# EAGLE design UV_MONITOR_V2_4 (EAGLE 8.4.0)
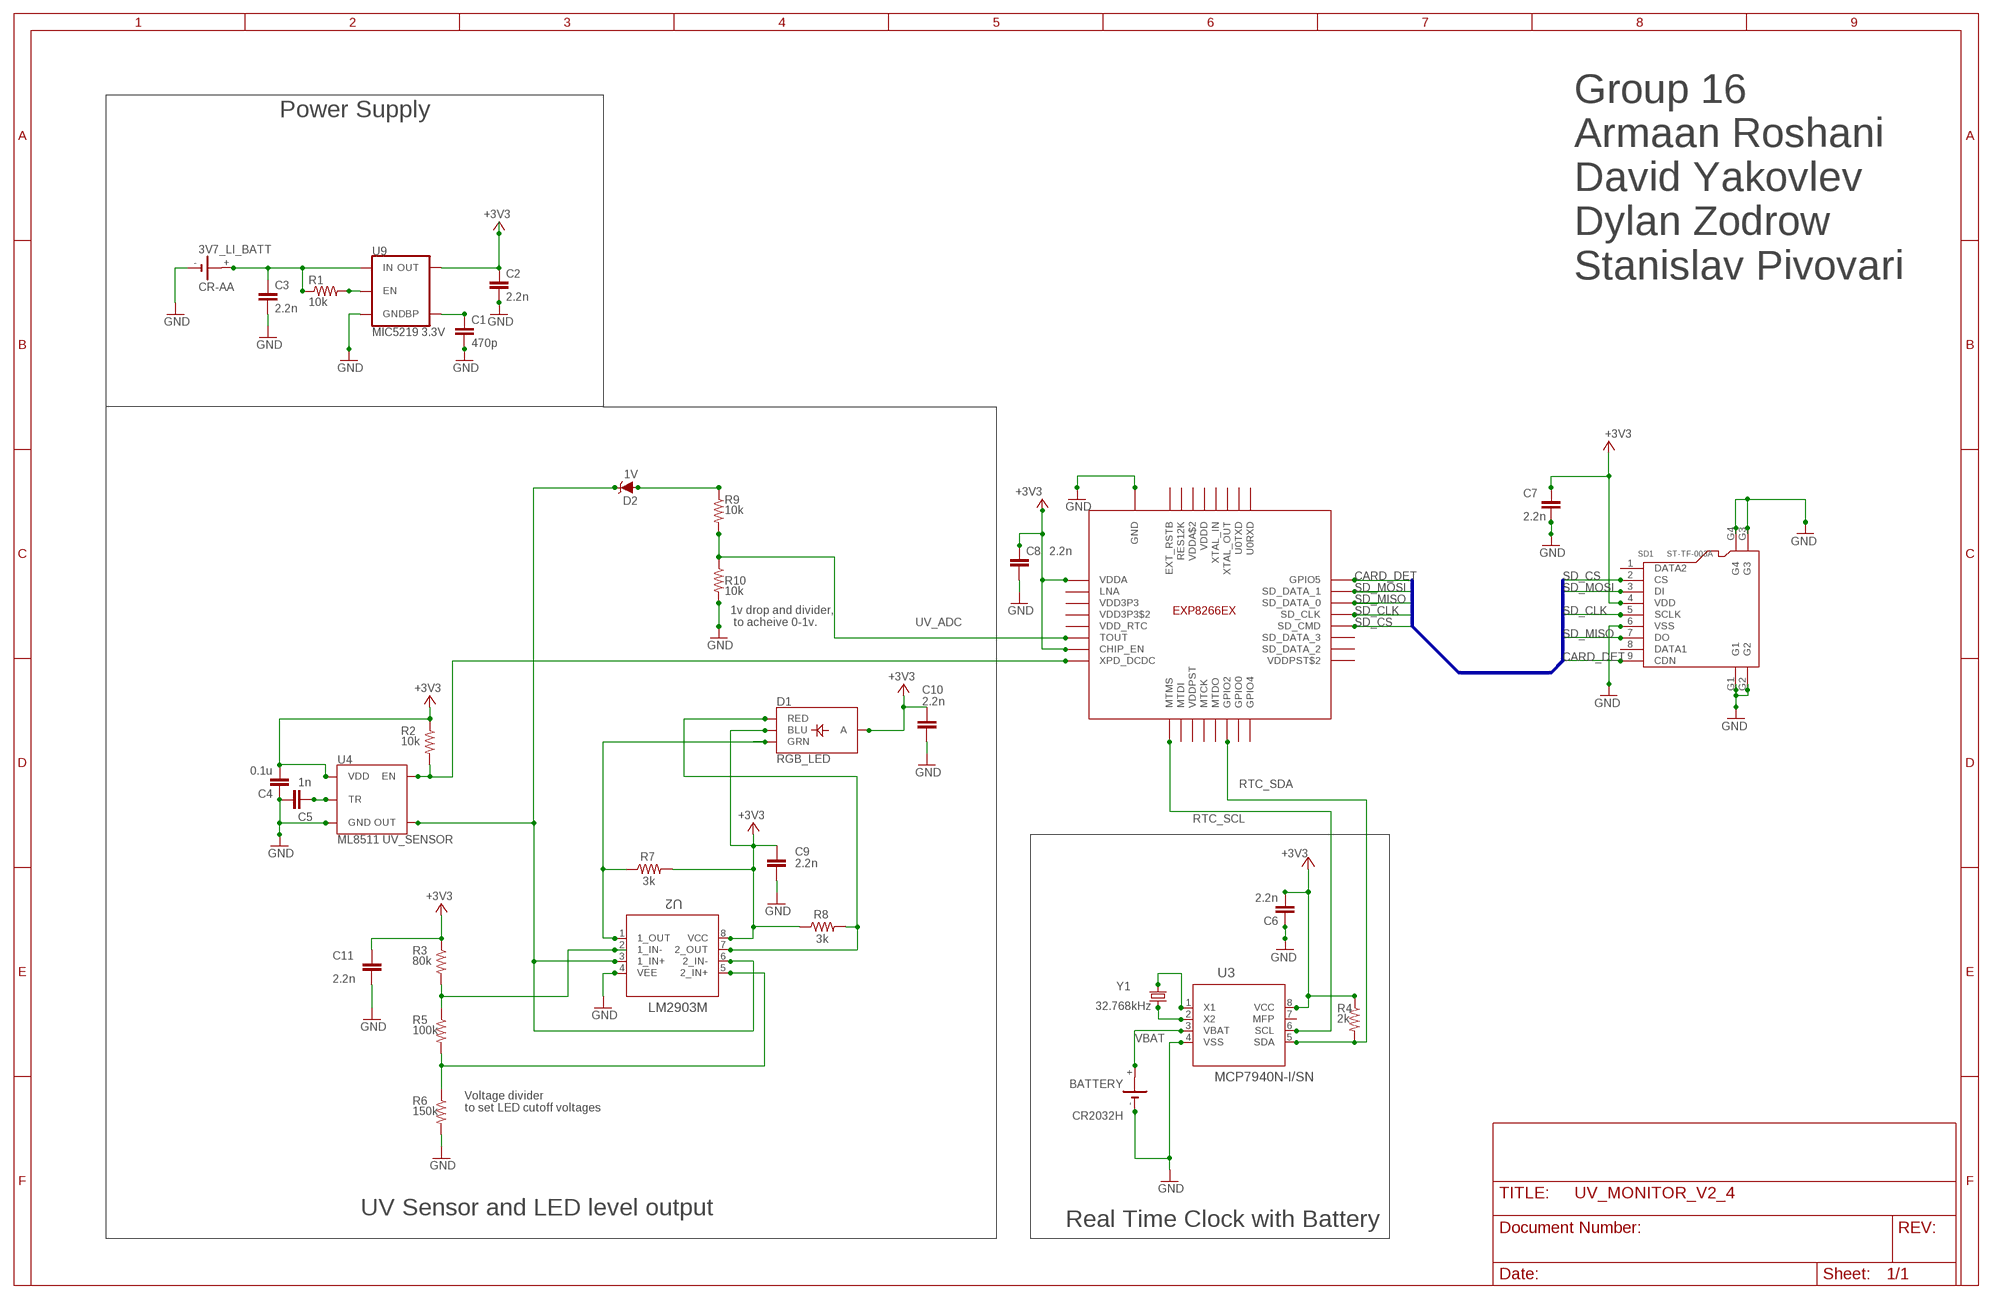
[diagram p0: schematic, sheet 1]

## Parts
3V7_LI_BATT  CR-AA  [CRAA]
BATTERY  CR2032H  [CR2032H]
C1  470p  C-EUC0805  [C0805]
C2  2.2n  C-EUC0805  [C0805]
C3  2.2n  C-EUC0805  [C0805]
C4  0.1u  C-EUC0805  [C0805]
C5  1n  C-EUC0805  [C0805]
C6  2.2n  C-EUC0805  [C0805]
C7  2.2n  C-EUC0805  [C0805]
C8  2.2n  C-EUC0805  [C0805]
C9  2.2n  C-EUC0805  [C0805]
C10  2.2n  C-EUC0805  [C0805]
C11  2.2n  C-EUC0805  [C0805]
D1  RGB_LED  LED-RGB-CASMD  [LED-TRICOLOR-SMD]
D2  1V  DIODE-ZENER-BZT52C3V6S  [SOD-323]
R1  10k  R-US_R0805  [R0805]
R2  10k  R-US_R0805  [R0805]
R3  80k  R-US_R0805  [R0805]
R4  2k  R-US_R0805  [R0805]
R5  100k  R-US_R0805  [R0805]
R6  150k  R-US_R0805  [R0805]
R7  3k  R-US_R0805  [R0805]
R8  3k  R-US_R0805  [R0805]
R9  10k  R-US_R0805  [R0805]
R10  10k  R-US_R0805  [R0805]
SD1  ST-TF-003A  MICRO-SD-CARD-SOCKET-9P(ST-TF-003A)  [MICRO-SD9+4P-SMD-16.1X14.5X1.85MM]
U1  ESP8266EX  [ESP8266EX]
U2  LM2903M  [M08A]
U3  MCP7940N-I/SN  [SOIC8-N_MC]
U4  ML8511 UV_SENSOR  ML8511  [ML8511]
U9  MIC5219 3.3V  V_REG_MIC52193.3V  [SOT23-5]
Y1  32.768kHz  CRYSTAL-32.768KHZSMD-2X6  [CRYSTAL-SMD-2X6-CYL]

## Nets
+3V3: C2.1 C4.2 C6.2 C7.1 C8.1 C9.1 C10.1 C11.1 D1.A D1.B(BLU) R2.1 R3.1 R4.1 R7.2 R8.1 SD1.4(VDD) U1.CHIP_EN U1.VDDA U2.8(VCC) U3.8(VCC) U4.7(VDD) U9.5(OUT)
BP: C1.1 U9.4(BP)
CARD_DET: SD1.9(CDN) U1.GPOIO5(GPIO5)
EN: R1.2 U9.3(EN)
GND: 3V7_LI_BATT.- BATTERY.- C1.2 C2.2 C3.2 C4.1 C5.2 C6.1 C7.2 C8.2 C9.2 C10.2 C11.2 R6.2 R10.2 SD1.6(VSS) SD1.G1 SD1.G2 SD1.G3 SD1.G4 U1.GND U2.4(VEE) U3.4(VSS) U4.5(GND) U9.2(GND)
GREEN_LED: D1.G(GRN) R7.1 U2.1(1_OUT)
H_REF: R3.2 R5.1 U2.2(1_IN-)
L_REF: R5.2 R6.1 U2.5(2_IN+)
MAIN_BAT: 3V7_LI_BATT.+ C3.1 R1.1 U9.1(IN)
N$2: U3.2(X2) Y1.X1
N$6: U3.1(X1) Y1.X2
RED_LED: D1.R(RED) R8.2 U2.7(2_OUT)
RTC_SCL: U1.MTMS U3.6(SCL)
RTC_SDA: R4.2 U1.GPIO2 U3.5(SDA)
SD_CLK: SD1.5(SCLK) U1.SD_CLK
SD_CS: SD1.2(CS) U1.SD_CMD
SD_MISO: SD1.7(DO) U1.SD_DATA_0
SD_MOSI: SD1.3(DI) U1.SD_DATA_1
TR: C5.1 U4.10(TR)
UV_ADC: R9.2 R10.1 U1.TOUT
UV_ADC_1: D2.A R9.1
UV_ADC_2: D2.C U2.3(1_IN+) U2.6(2_IN-) U4.8(OUT)
UV_SEN_EN: R2.2 U1.XPD_DCDC U4.4(EN)
VBAT: BATTERY.+ U3.3(VBAT)
Unconnected: 3V7_LI_BATT.+@1(+) BATTERY.+@1(+) SD1.1(DATA2) SD1.8(DATA1) U1.EXT_RSTB U1.GPIO0 U1.GPIO4 U1.LNA U1.MTCK U1.MTDI U1.MTDO U1.RES12K U1.SD_DATA_2 U1.SD_DATA_3 U1.U0RXD U1.U0TXD U1.VDD3P3 U1.VDD3P3$2 U1.VDD_RTC U1.VDDA$2 U1.VDDD U1.VDDPST U1.VDDPST$2 U1.XTAL_IN U1.XTAL_OUT U3.7(MFP)

## Buses
SD_CARD

## Notes on the sheet
- Power Supply
- Group 16
  Armaan Roshani
  David Yakovlev
  Dylan Zodrow
  Stanislav Pivovari
- 1v drop and divider,
   to acheive 0-1v.
- Voltage divider
  to set LED cutoff voltages
- UV Sensor and LED level output
- Real Time Clock with Battery

## Library data of the parts
3V7_LI_BATT = battery:CR-AA: LI BATTERY Varta CRAA-SLF
BATTERY = battery:CR2032H: LI BATTERY Varta
C1-C11 = rcl:C-EU: CAPACITOR, European symbol
D1 = SparkFun-LED:LED-RGB-CA: LED-RGB Diffused Common Anode Packages: LED RGB-THRU P-LCC-4-3 LED-TRICOLOR-SMD SparkFun Products: RGB Diffused Common Anode- Diffuse <[https://www.sparkfun.com/products/10821]> RGB Diffused Common Anode - Clear <[https://www.sparkfun.com/products/10820]> Qduino Mini <[https://www.sparkfun.com/products/13614]> Triple Output LED RGB - SMD <https://www.sparkfun.com/products/7844>; PROD_ID: DIO-08324
D2 = SparkFun-DiscreteSemi:DIODE-ZENER: Zener Diode A Zener diode allows current to flow from its anode to its cathode like a normal semiconductor diode, but it also permits current to flow in the reverse direction when its "Zener voltage" is reached. - WIkipedia; PROD_ID: DIO-08199; VALUE: 3.6V
R1-R10 = rcl:R-US_: RESISTOR, American symbol
SD1 = Seeed-Connector:MICRO-SD-CARD-SOCKET-9P(ST-TF-003A): 320090000; MPN: ST-TF-003A
U1 = ESP8266EX:ESP8266EX
U2 = LM2903M:LM2903M; MANUFACTURER_PART_NUMBER: LM2903M; VENDOR: Texas Instruments
U3 = MCP7940N:MCP7940N-I/SN; MANUFACTURER_PART_NUMBER: MCP7940NISN; VENDOR: MICROCHIP
U4 = SparkFun-Sensors:ML8511: Lapis ML8511 Ultraviolet Sensor The MP8511 UV (ultraviolet) Sensor works by outputing an analog signal in relation to the amount of UV light that’s detected. This sensor detects 280-390nm light most effectively. This is categorized as part of the UVB (burning rays) spectrum and most of the UVA (tanning rays) spectrum. It outputs a analog voltage that is linearly related to the measured UV intensity (mW/cm2). Datasheet <https://cdn.sparkfun.com/datasheets/Sensors/LightImaging/ML8511_3-8-13.pdf> SparkFun Products SparkFun UV Sensor Breakout - ML8511 <https://www.sparkfun.com/products/12705> (SEN-12705); PROD_ID: IC-11927
U9 = SparkFun-IC-Power:V_REG_MIC5219: V_REG MIC5219 Standard 3.3V and 5V 500mA LDO voltage regulator in SOT-23 layout. Micrel part MIC5219. BP (by-pass) pin is used to lower output noise with 470pF cap, may be left open.; PROD_ID: VREG-09872
Y1 = SparkFun-Clocks:CRYSTAL-32.768KHZ: 32.768kHz Crystal Frequency: 32.768kHz Frequency Stability: ±20ppm Load Capacitance: 12.5pF (PTH-2X6 & SMD-3.2X1.5), 6pF (SMD-2X6) SparkFun Products: SparkFun BigTime Watch Kit <https://www.sparkfun.com/products/11734> SparkFun nRF52832 Breakout <https://www.sparkfun.com/products/13990> SparkFun Real Time Clock Module <https://www.sparkfun.com/products/12708>; PROD_ID: XTAL-07894

## Net classes
0 default: clearance 0.205 mm

## Board
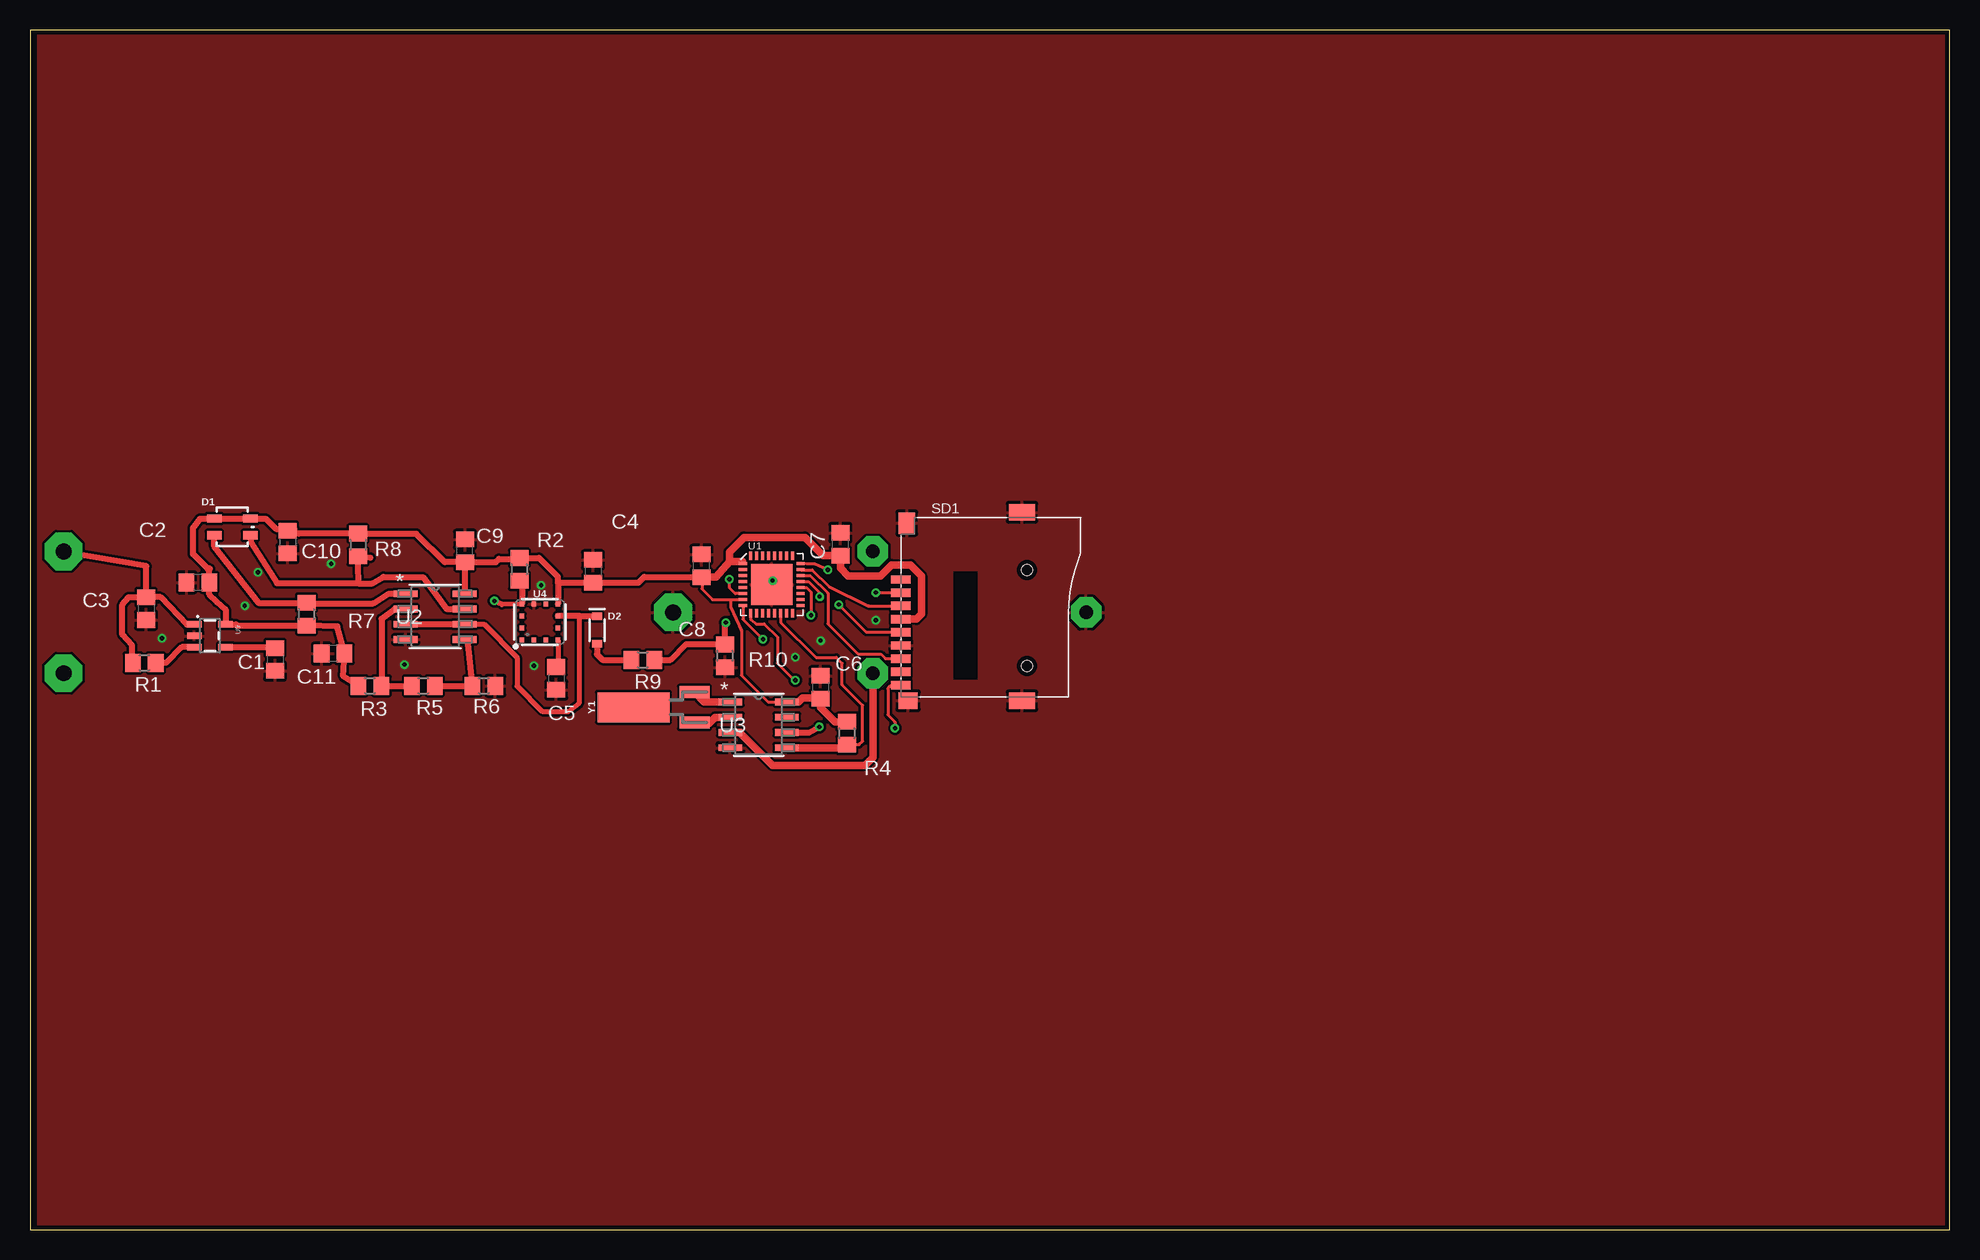
[diagram p1: board, top side]
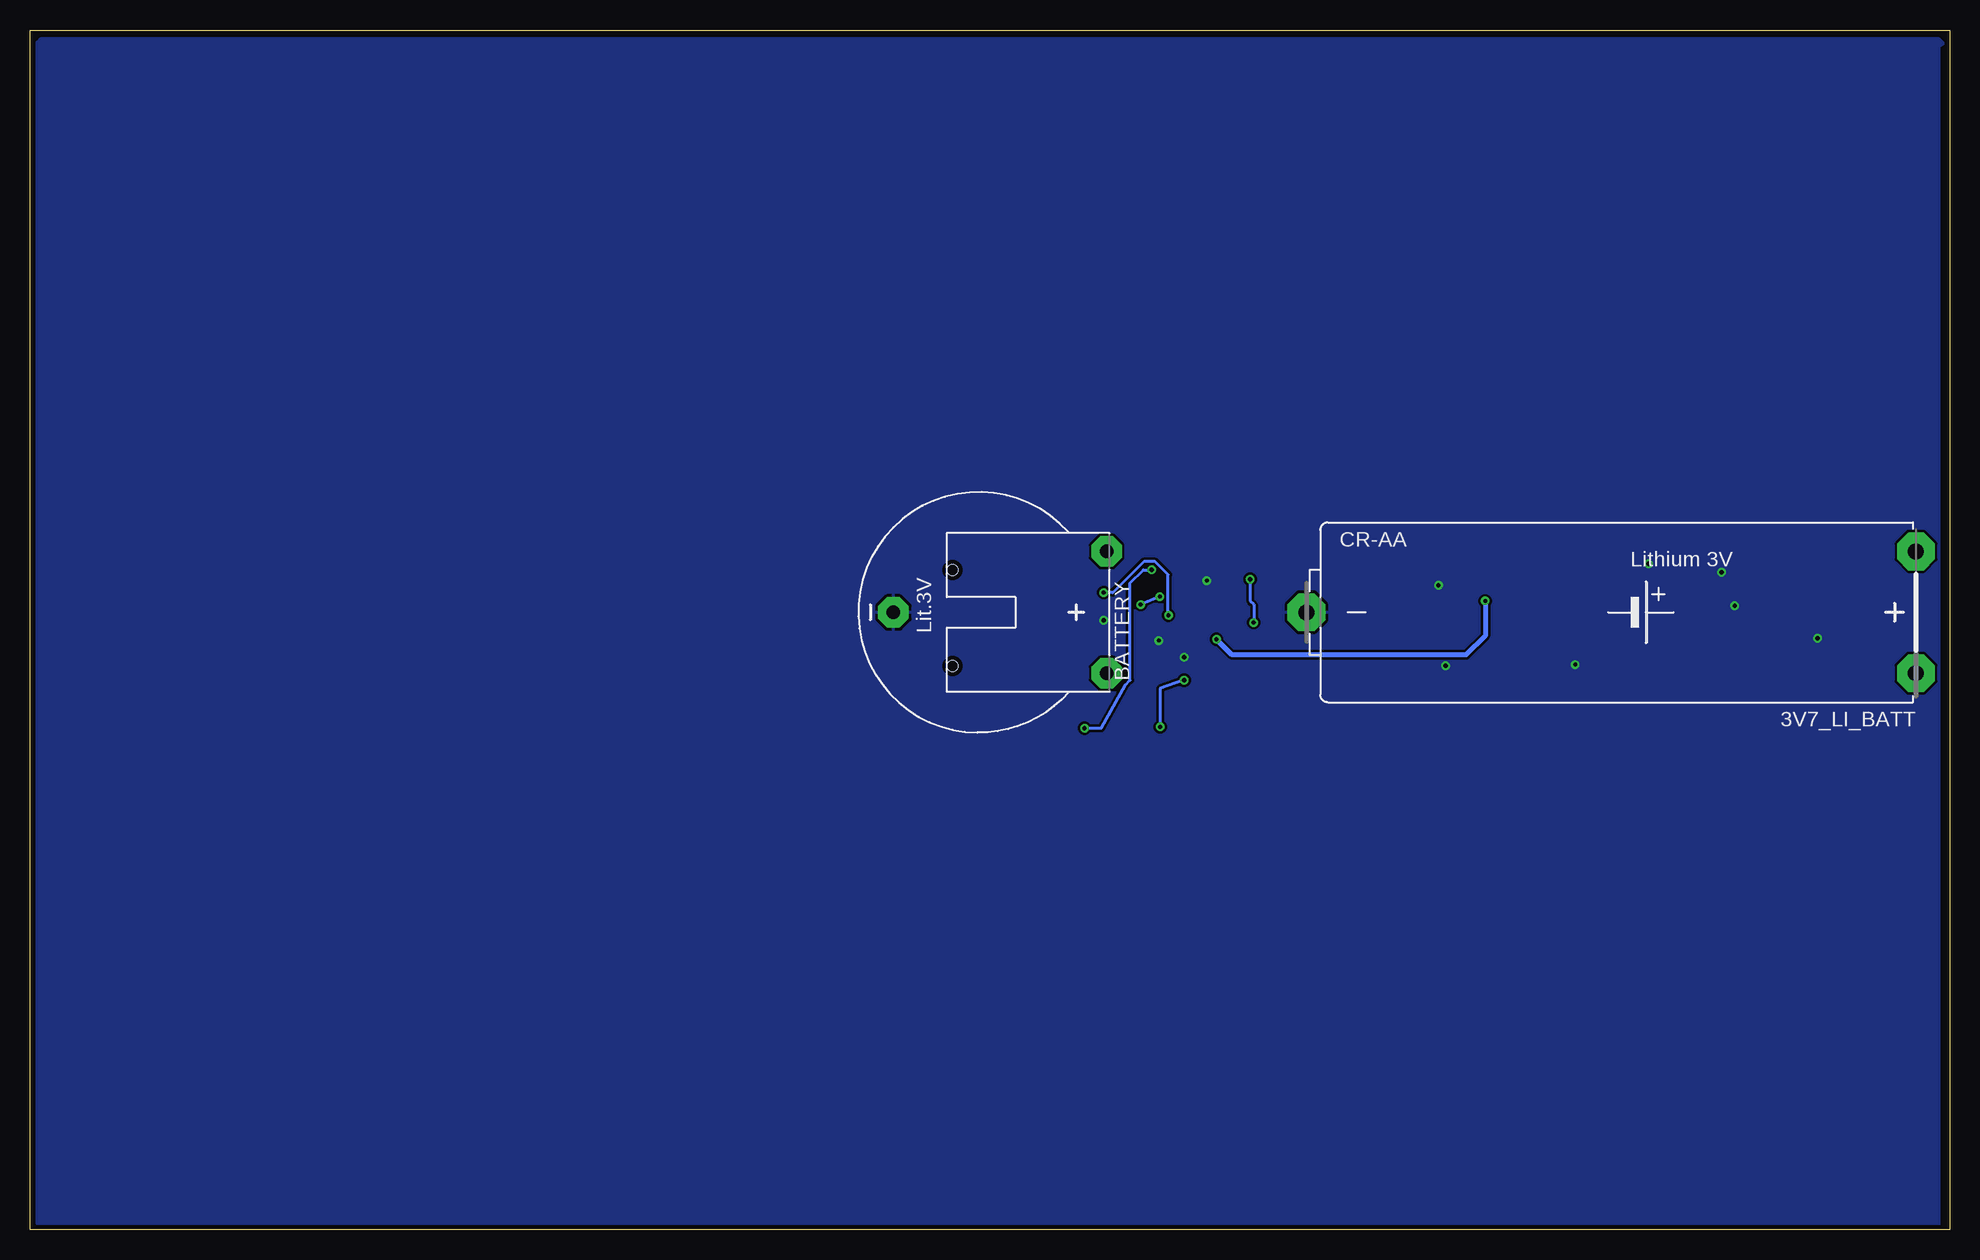
[diagram p2: board, bottom side, seen from below]

Size 160 x 100 mm. Coordinates in mm from the lower left corner, seen from the top.
Outline: 0,0 160,0 160,100 0,100 0,0
Copper layers (1*16): Top 0.0356mm / dielectric 1.5011mm / Bottom 0.0356mm
Design rules "osh-park-2-layers-design-rules": minimum track width 6mil, minimum drill 10mil, track to track 6mil, track to pad 6mil, pad to pad 6mil, via to via 6mil, smd to smd 6mil, copper to edge 15mil, drill to drill 6mil, minimum pad ring 7mil, minimum via ring 7mil, stop-mask expansion 3mil, vias tented up to drill 0mil, thermal gap 10mil

### Footprints (pad centres in the part's own frame; a part is rotated, then mirrored left to right if it is on the bottom)
CRAA = drill 1.321 pad 3.15 octagon: + -25.4,-5.08; +@1 -25.4,5.08; - 25.4,0
CR2032H = drill 1.118 pad 2.54 octagon: + 5.08,10.795; +@1 -5.08,10.795; - 0,-6.985
C0805 = smd 1.3 x 1.5: 1 -0.95,0; 2 0.95,0
LED-TRICOLOR-SMD = smd 1.2 x 0.7: A 1.5,0.7; B -1.5,0.7; G -1.5,-0.7; R 1.5,-0.7
SOD-323 = smd 0.63 x 0.83: A 1.15,0; C -1.15,0
R0805 = smd 1.3 x 1.5: 1 -0.95,0; 2 0.95,0
MICRO-SD9+4P-SMD-16.1X14.5X1.85MM = smd 1.6 x 0.7: 1 0,2.25; 2 0,1.15; 3 0,0.05; 4 0,-1.05; 5 0,-2.15; 6 0,-3.25; 7 0,-4.35; 8 0,-5.45; 9 0,-6.55 | smd 1.6 x 1.4: G1 0.6,-7.85 | smd 2.2 x 1.4: G2 10.1,-7.85; G3 10.1,7.85 | smd 1.4 x 1.8: G4 0.5,6.95 | hole 0.9: 10.5,-4.95; 10.5,3.05
ESP8266EX = smd 0.7 x 0.25: CHIP_EN -2.4,-1.25; GPOIO5 2.4,1.75; LNA -2.4,1.25; SD_CLK 2.4,0.25; SD_CMD 2.4,-0.25; SD_DATA_0 2.4,0.75; SD_DATA_1 2.4,1.25; SD_DATA_2 2.4,-1.25; SD_DATA_3 2.4,-0.75; TOUT -2.4,-0.75; VDD3P3 -2.4,0.75; VDD3P3$2 -2.4,0.25; VDD_RTC -2.4,-0.25; VDDA -2.4,1.75; VDDPST$2 2.4,-1.75; XPD_DCDC -2.4,-1.75 | smd 0.25 x 0.7: EXT_RSTB -1.75,2.4; GPIO0 1.25,-2.4; GPIO2 0.75,-2.4; GPIO4 1.75,-2.4; MTCK -0.25,-2.4; MTDI -1.25,-2.4; MTDO 0.25,-2.4; MTMS -1.75,-2.4; RES12K -1.25,2.4; U0RXD 1.75,2.4; U0TXD 1.25,2.4; VDDA$2 -0.75,2.4; VDDD -0.25,2.4; VDDPST -0.75,-2.4; XTAL_IN 0.25,2.4; XTAL_OUT 0.75,2.4 | smd 3.45 x 3.45: GND 0,0
M08A = smd 1.981 x 0.559: 1 -2.464,1.905; 2 -2.464,0.635; 3 -2.464,-0.635; 4 -2.464,-1.905; 5 2.464,-1.905; 6 2.464,-0.635; 7 2.464,0.635; 8 2.464,1.905
SOIC8-N_MC = smd 1.981 x 0.559: 1 -2.362,1.905; 2 -2.362,0.635; 3 -2.362,-0.635; 4 -2.362,-1.905; 5 2.362,-1.905; 6 2.362,-0.635; 7 2.362,0.635; 8 2.362,1.905
ML8511 = smd 0.4 x 0.4: 1 -1.5,-1.5; 2 -1.5,-0.5; 3 -1.5,0.5; 4 -1.5,1.5; 5 -0.5,1.5; 6 0.5,1.5; 7 1.5,1.5; 8 1.5,0.5; 9 1.5,-0.5; 10 1.5,-1.5; 11 0.5,-1.5; 12 -0.5,-1.5
SOT23-5 = smd 0.55 x 1.2: 1 -0.95,-1.3; 2 0,-1.3; 3 0.95,-1.3; 4 0.95,1.3; 5 -0.95,1.3
CRYSTAL-SMD-2X6-CYL = smd 2.5 x 6: SHEILD 0,5.08 | smd 1 x 2.5: X1 -1.27,0; X2 1.27,0

### Placement (x,y rotation side)
3V7_LI_BATT  28.2,51.45 180 bottom
BATTERY  81.05,51.45 270 bottom
C1  20.43,47.52 270 top
C2  14,53.95 180 top
C3  9.68,51.76 270 top
C4  46.93,54.87 270 top
C5  43.87,45.95 270 top
C6  65.89,45.21 270 top
C7  67.55,57.13 90 top
C8  55.97,55.33 90 top
C9  36.25,56.58 90 top
C10  21.47,57.31 270 top
C11  25.26,48.02 180 top
D1  16.86,58.57 0 top
D2  47.26,49.97 270 top
R1  9.53,47.25 0 top
R2  40.8,55.03 270 top
R3  28.34,45.33 0 top
R4  68.09,41.37 270 top
R5  32.79,45.33 0 top
R6  37.84,45.33 0 top
R7  23.05,51.3 270 top
R8  27.35,57.07 270 top
R9  51.08,47.49 0 top
R10  57.92,47.82 270 top
SD1  72.59,51.94 0 top
U1  61.83,53.77 0 top
U2  33.77,51.1 0 top
U3  60.73,42.07 0 top
U4  42.5,50.65 0 top
U9  15,49.5 270 top
Y1  55.38,43.54 90 top

### Tracks (layer width: path | path; a pad name or v marks a point on that pad's centre or on a via)
+3V3
  Top 0.254: 59.41,55.7 U1.VDDA | C8.1 56,54.35 56,53.4 56.88,52.52 58.4,52.52 | 58.4,52.52 U1.CHIP_EN | 58.4,52.52 58.4,51.9 59.3,49.9 59.3,46.2 61.52,43.98 U3.8
  Top 0.508: 16.3,51.7 U9.5 17.15,50.45 17.25,50.35 R7.2 25.61,50.29 C11.1 26.11,46.11 R3.1 | 16.3,51.7 | 16.3,51.7 15.6,52.3 14.95,52.95 C2.1 14.95,55.05 15,55.1 14.8,55.1 13.6,56.3 13.6,58.5 14.17,59.27 D1.B D1.A 19.63,59.27 20.5,58.4 22.03,58.4 C10.1 22.41,58.02 R8.1 27.37,58 32.2,58 34.57,55.63 C9.1 | C9.1 36.23,55.61 U2.8 | C9.1 38.83,55.63 39.1,55.9 40.72,55.9 R2.1 42.42,55.98 44,54.4 44,53.9 | 44,53.9 U4.7 | 44,53.9 44.02,53.92 C4.2 50.72,53.92 51.2,54.4 55.95,54.4 C8.1
  Top 0.61: C8.1 57.18,54.38 58.3,55.7 | 58.3,55.7 59.41,55.7 | U3.8 64.08,43.98 64.4,44.3 65.85,44.3 C6.2 65.89,43.51 67.1,42.3 68.07,42.3 R4.1 | 58.3,55.7 58.3,56.5 59.5,57.7 64.6,57.7 66.1,56.2 67.53,56.2 C7.1 67.55,55.15 68.2,54.5 70.9,54.5 71.8,55.4 73.4,55.4 74.3,54.5 74.3,51.3 73.89,50.89 SD1.4
BP
  Top 0.508: U9.4 20.29,48.55 arc90 C1.1
CARD_DET  (via drill 0.35)
  Top 0.254: U1.GPOIO5 64.75,55.5 65.4,55.5 v66.5,55 | SD1.9 72.5,45.3 71.7,45.3 71.5,45.1 71.5,42.9 72.1,42.3 v72.1,41.8
  Bottom 0.254: v72.1,41.8 70.7,41.8 68.7,45.4 68.3,45.8 68.3,53.9 67.2,55 v66.5,55
EN
  Top 0.508: U9.3 12.65,48.55 11.35,47.25 R1.2
GND  (via drill 0.35)
  other vias: 17.9,52 19,54.8 25.1,55.5 63.8,47.7 65.9,49.1 31.2,47.1 70.5,50.8 11,49.3 42,47 42.6,53.7 61.9,54.1
  pour Bottom: 0.9,98.6 0.9,0.4 1,0.3 159.2,0.3 159.4,0.5 159.4,99 159.1,99.3 0.9,99.3 0.5,98.9
  pour Top: 0.7,99.5 0.7,0.2 0.5,0 159.1,0 159.8,0.7 159.8,99.4 159.6,99.6 0.5,99.6
GREEN_LED
  Top 0.508: D1.G 15.36,56.94 19.05,52.25 R7.1 23.1,52.2 28.6,52.2 29.91,53.01 U2.1
H_REF
  Top 0.508: 29.4,45.33 R3.2 | 29.4,45.33 R5.1 | U2.2 30.43,51.73 29.3,50.9 29.3,45.43 29.4,45.33
L_REF
  Top 0.508: R5.2 R6.1 36.49,49.24 U2.5
MAIN_BAT
  Top 0.508: C3.1 10.89,52.71 13.1,50.4 13.65,50.45 U9.1 | R1.1 8.5,47.33 8.5,48.7 7.7,49.6 7.7,52.1 8.21,52.71 C3.1 | C3.1 9.7,52.73 9.7,55.3 2.8,56.5 3V7_LI_BATT.+
N$2
  Top 0.61: U3.2 57.1,42.7 56.6,42.2 55.45,42.2 Y1.X1
N$6
  Top 0.61: U3.1 57.33,43.98 57.3,44 56.19,44 Y1.X2
RED_LED
  Top 0.508: D1.R 18.4,57.33 20.6,53.87 27.4,53.87 | 27.4,53.87 28.52,53.87 29.45,54.41 32.77,54.39 34.72,51.73 U2.7 | 28.37,56 R8.2 27.32,54.84 27.4,53.87
RTC_SCL  (via drill 0.35)
  Top 0.254: U1.MTMS 60.1,50.85 60.5,50.5 61.2,50.5 62.3,49.4 62.3,47.2 63.7,45.8 v63.8,45.8
  Top 0.508: U3.6 64.94,41.44 v65.8,41.9
  Bottom 0.254: v63.8,45.8 65.8,45.1 v65.8,41.9
RTC_SDA
  Top 0.254: U1.GPIO2 62.58,50.62 65.5,47.7 67.2,47.7 67.7,47.2 67.7,45.4 69.4,43.7 69.4,40.7 69.12,40.42 R4.2
  Top 0.61: U3.5 67.83,40.16 R4.2
SD_CLK  (via drill 0.35)
  Top 0.254: U1.SD_CLK 64.88,54.02 65.81,53.09 v65.81,52.77 | SD1.5 69.72,49.79 v67.42,52.1
  Bottom 0.254: v65.81,52.77 v67.42,52.1
SD_CS  (via drill 0.35)
  Top 0.254: U1.SD_CMD 64.73,53.52 65.1,53.15 v65.1,51.2 | v70.5,53.1 SD1.2
  Bottom 0.254: v65.1,51.2 65.13,51.23 65.13,54.6 66.22,55.69 67.16,55.69 69.75,53.1 v70.5,53.1
SD_MISO
  Top 0.254: U1.SD_DATA_0 65.03,54.52 66.5,53.05 66.5,50.5 69.03,47.97 70.92,47.97 71.3,47.59 SD1.7
SD_MOSI
  Top 0.254: U1.SD_DATA_1 64.25,55 65.2,55 66.61,53.59 69.91,51.99 SD1.3
TR
  Top 0.406: U4.10 44,47.03 C5.1
UV_ADC  (via drill 0.35)
  Top 0.254: U1.TOUT 58.78,53.02 58.3,53.5 v58.3,54.2
  Top 0.508: R9.2 53.39,47.49 54.7,48.8 57.89,48.8 R10.1 57.92,50.52 v58,50.6
  Bottom 0.254: v58.3,54.2 58.3,52.4 58,52.1 v58,50.6
UV_ADC_1
  Top 0.508: D2.A 47.26,47.94 47.71,47.49 R9.1
UV_ADC_2
  Top 0.406: U2.6 37.84,50.47 40.6,47.7 40.6,45.3 42.7,43.2 44.9,43.2 45.8,43.9 45.8,51.15
  Top 0.508: U2.3 U2.6 | U4.8 45.8,51.15 47.23,51.15 D2.C
UV_SEN_EN  (via drill 0.35)
  Top 0.254: U1.XPD_DCDC 59.43,50.87 v61.1,49.2
  Top 0.406: U4.4 39.35,52.1 v38.7,52.4
  Top 0.508: R2.2 41,53.88 U4.4
  Bottom 0.406: v38.7,52.4 38.7,49.5 40.3,47.9 59.8,47.9 v61.1,49.2
VBAT
  Top 0.61: U3.3 59.16,41.44 61.9,38.7 69.6,38.7 | 69.6,38.7 69.8,38.9 | BATTERY.+ 70.25,39.35 69.6,38.7